# Altium schematic sheet badge2.SchDoc
size Letter
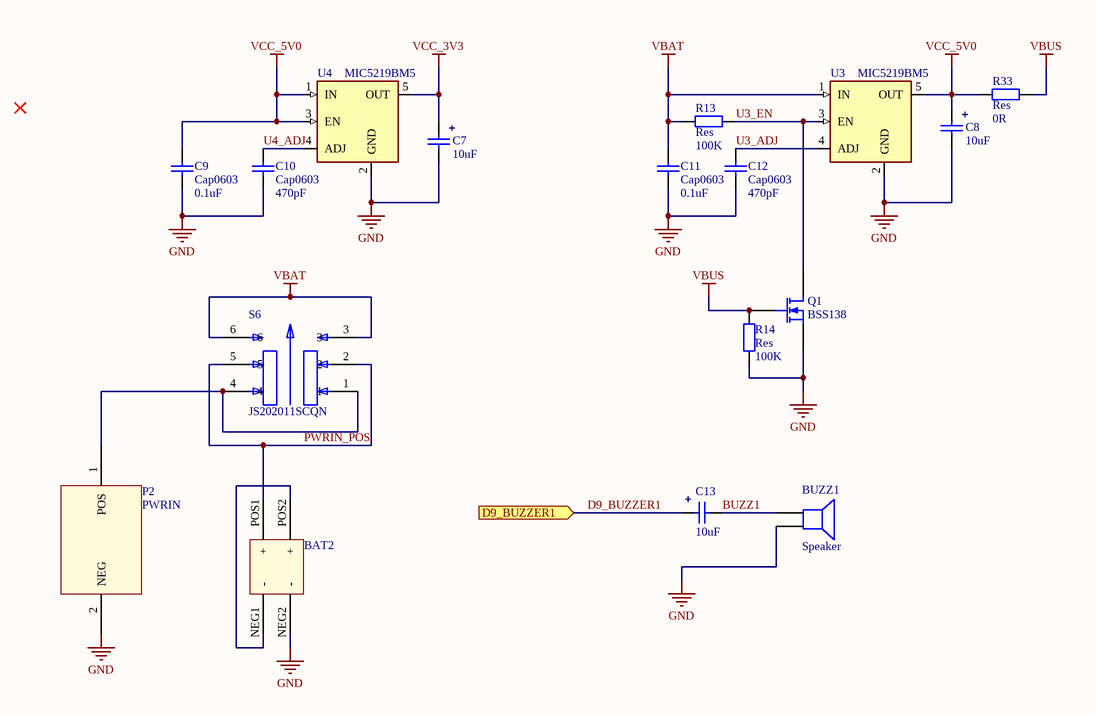
[diagram p0: badge2.SchDoc]

## Parts
BAT2  BATT_18650x2  [BATT_18650x2]  (value not drawn)
BUZZ1  Speaker  [SMC]
C7  value 10uF  [C1206 _POL]
C8  value 10uF  [C1206 _POL]
C9  Cap0603  value 0.1uF  [C0603]
C10  Cap0603  value 470pF  [C0603]
C11  Cap0603  value 0.1uF  [C0603]
C12  Cap0603  value 470pF  [C0603]
C13  value 10uF  [C1206 _POL]
P2  PWRIN  [PWRIN]
Q1  BSS138  [SOT23_N]
R13  Res  value 100K  [R0603]
R14  Res  value 100K  [R0603]
R33  Res  value 0R  [R0603]
S6  JS202011SCQN  [SW_JS202011SCQN]
U3  MIC5219BM5  [SOT23-5_N]
U4  MIC5219BM5  [SOT23-5_N]

## Ports
D9_BUZZER1 (in)

## Nets
GND: BAT2.NEG2(-) BUZZ1.2 C7.2 C8.2 C9.1 C10.1 C11.1 C12.1 P2.2(NEG) Q1.2(S) R14.1 U3.2(GND) U4.2(GND)
VBAT: C11.2 R13.1 S6.3 S6.6 U3.1(IN)
VBUS: Q1.3(G) R14.2 R33.2
VCC_3V3: C7.1 U4.5(OUT)
VCC_5V0: C8.1 C9.2 R33.1 U3.5(OUT) U4.1(IN) U4.3(EN)
BUZZ1: BUZZ1.1 C13.2
D9_BUZZER1: C13.1 ; port D9_BUZZER1
PWRIN_POS: BAT2.POS1(+) S6.2 S6.5
U3_ADJ: C12.2 U3.4(ADJ)
U3_EN: Q1.1(D) R13.2 U3.3(EN)
U4_ADJ: C10.2 U4.4(ADJ)
NetBAT2_NEG1: BAT2.NEG1(-) BAT2.POS2(+)
NetP2_1: P2.1(POS) S6.1 S6.4

## Notes on the sheet
- (in symbol CapPol) +

## Library data of the parts
BAT2 = BATT_18650x2: MF: DNP; MP: DNP
BUZZ1 = Speaker: Loudspeaker; MF: DNP; Published: 24-Mar-1999; LatestRevisionDate: 17-Jul-2002; LatestRevisionNote: Re-released for DXP Platform.; PackageReference: PIN2; Publisher: Altium Limited; MP: DNP
C7 C8 C13 = CapPol: Capacitor; MF: KEMET; MP: T491A106K010AT; Published: 8-Jun-2000; LatestRevisionDate: 17-Jul-2002; LatestRevisionNote: Re-released for DXP Platform.; PackageReference: CAP_POL; Publisher: Altium Limited; PackageDescription: SMD Capacitor
C9 = Cap0603: Capacitor; MF: KEMET; MP: C0603C104Z3VACTU; Published: 8-Jun-2000; LatestRevisionDate: 17-Jul-2002; LatestRevisionNote: Re-released for DXP Platform.; PackageReference: 0603; Publisher: Altium Limited; PackageDescription: SMD Capacitor
C10 C12 = Cap0603: Capacitor; MF: KEMET; MP: C0603C471J1GACTU; Published: 8-Jun-2000; LatestRevisionDate: 17-Jul-2002; LatestRevisionNote: Re-released for DXP Platform.; PackageReference: 0603; Publisher: Altium Limited; PackageDescription: SMD Capacitor
C11 = Cap0603: Capacitor; MF: KEMET; MP: C0603C104M4RACTU; Published: 8-Jun-2000; LatestRevisionDate: 17-Jul-2002; LatestRevisionNote: Re-released for DXP Platform.; PackageReference: 0603; Publisher: Altium Limited; PackageDescription: SMD Capacitor
P2 = PWRIN: MF: Molex; MP: S2B-PH-SM4-TB(LF)(SN)
Q1 = MOSFET-N: N-Channel MOSFET; MF: ON Semiconductor; MP: ATSAMD11C14A-SSNTDKR-ND; Published: 8-Jun-2000; LatestRevisionDate: 17-Jul-2002; LatestRevisionNote: Re-released for DXP Platform.; PackageVersion: 1995/1996; PackageReference: E3; Publisher: Altium Limited; PackageDescription: TO, Flat Index; 3 In-Line, Axial Leads; Body Dia. 4.6mm; Lead Dia. 0.5 mm (max)
R13 R14 = Res: Resistor; MF: Yageo; MP: RC0603JR-07100KL; Published: 8-Jun-2000; LatestRevisionDate: 17-Jul-2002; LatestRevisionNote: Re-released for DXP Platform.; PackageReference: AXIAL-0.4; Publisher: Altium Limited; PackageDescription: SMD Resistor
R33 = Res: Resistor; MF: Yageo; MP: RC0603JR-070RL; Published: 8-Jun-2000; LatestRevisionDate: 17-Jul-2002; LatestRevisionNote: Re-released for DXP Platform.; PackageReference: AXIAL-0.4; Publisher: Altium Limited; PackageDescription: SMD Resistor
S6 = JS202011SCQN: Slide Switch DPDT Surface Mount; MF: C&K; MP: JS202011SCQN; Value: *; Package: None; SnapEDA_Link: https://www.snapeda.com/parts/JS202011SCQN/C%26K/view-part/592122/?ref=snap; Digi-Key_Part_Number: 401-2002-1-ND; Digi-Key_Purchase_URL: https://www.digikey.com/product-detail/en/c-k/JS202011SCQN/401-2002-1-ND/1640098?utm_source=snapeda&utm_medium=aggregator&utm_campaign=symbol
U3 U4 = MIC5219BM5: Linear Voltage Regulator IC 1 Output 500mA SOT-23-5; MF: Micrel; Package: SOT-753 Micrel; Value: *; Price: None; MP: MIC5219BM5; Availability: Unavailable; SnapEDA_Link: https://www.snapeda.com/parts/MIC5219BM5/Micrel/view-part/553192/?ref=snap